# Altium schematic sheet light_key_control.SchDoc
size A3; DocumentNumber: 6; Revision: V1.0; SheetNumber: 6; SheetTotal: 9
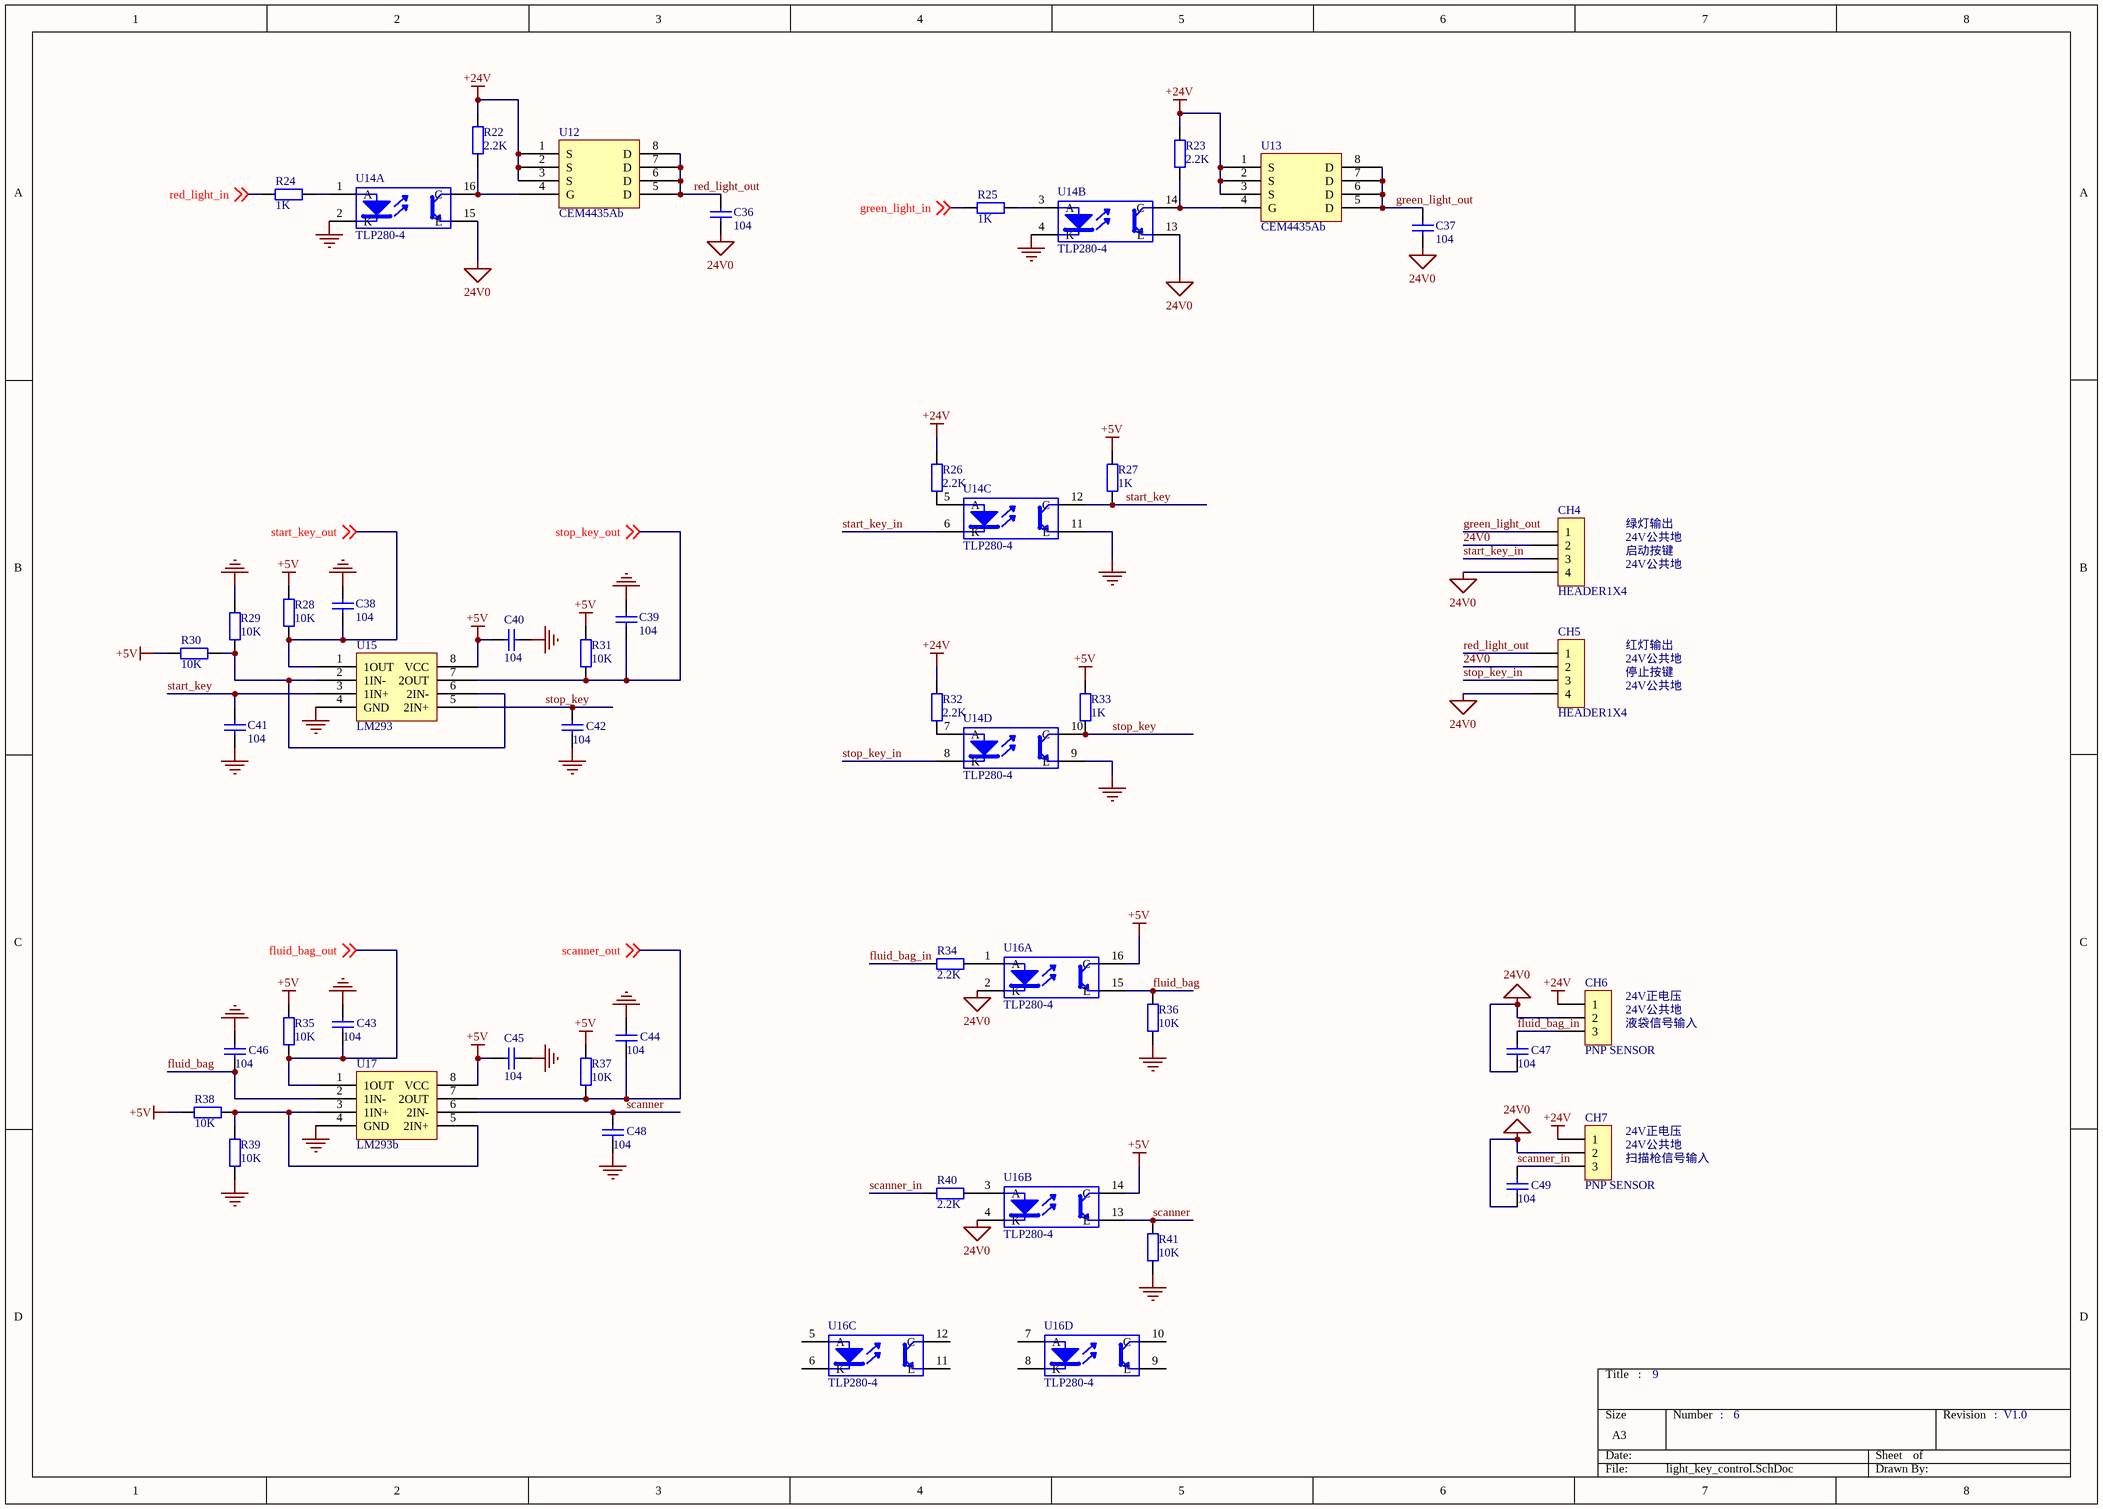
[diagram p0: light_key_control.SchDoc]

## Parts
C36  value 104  [0805]  (hidden comment: Capb)
C37  value 104  [0805]  (hidden comment: Capb)
C38  value 104  [0805]  (hidden comment: Cap)
C39  value 104  [0805]  (hidden comment: Cap)
C40  value 104  [0805]  (hidden comment: Cap)
C41  value 104  [0805]  (hidden comment: Cap)
C42  value 104  [0805]  (hidden comment: Cap)
C43  value 104  [0805]  (hidden comment: Capb)
C44  value 104  [0805]  (hidden comment: Capb)
C45  value 104  [0805]  (hidden comment: Cap)
C46  value 104  [0805]  (hidden comment: Cap)
C47  value 104  [0805]  (hidden comment: Capb)
C48  value 104  [0805]  (hidden comment: Cap)
C49  value 104  [0805]  (hidden comment: Capb)
CH4  HEADER1X4  [CH3.96-4PIN]
CH5  HEADER1X4  [CH3.96-4PIN]
CH6  HEADER1X3  [CH3.96-3PIN]  (value not drawn)
CH7  HEADER1X3  [CH3.96-3PIN]  (value not drawn)
R22  value 2.2K  [0805]  (hidden comment: Res2)
R23  value 2.2K  [0805]  (hidden comment: Res2)
R24  value 1K  [0805]  (hidden comment: Res2)
R25  value 1K  [0805]  (hidden comment: Res2)
R26  value 2.2K  [0805]  (hidden comment: Res2)
R27  value 1K  [0805]  (hidden comment: Res2)
R28  value 10K  [0805]  (hidden comment: Res2)
R29  value 10K  [0805]  (hidden comment: Res2)
R30  value 10K  [0805]  (hidden comment: Res2)
R31  value 10K  [0805]  (hidden comment: Res2)
R32  value 2.2K  [0805]  (hidden comment: Res2)
R33  value 1K  [0805]  (hidden comment: Res2)
R34  value 2.2K  [0805]  (hidden comment: Res2)
R35  value 10K  [0805]  (hidden comment: Res2b)
R36  value 10K  [0805]  (hidden comment: Res2)
R37  value 10K  [0805]  (hidden comment: Res2b)
R38  value 10K  [0805]  (hidden comment: Res2b)
R39  value 10K  [0805]  (hidden comment: Res2b)
R40  value 2.2K  [0805]  (hidden comment: Res2)
R41  value 10K  [0805]  (hidden comment: Res2)
U12  CEM4435Ab  [SOP8-OP27]
U13  CEM4435Ab  [SOP8-OP27]
U14  TLP280-4  [SO16]  (parts A,B,C,D of 4)
U15  LM293  [SOP8-OP27]
U16  TLP280-4  [SO16]  (parts A,B,C,D of 4)
U17  LM293b  [SOP8-OP27]

## Nets
24V0: C36.2 C37.2 C47.1 C49.1 CH4.2 CH4.4 CH5.2 CH5.4 CH6.2 CH7.2 U14.13(E) U14.15(E) U16.2(K) U16.4(K)
+5V: C40.2 C45.2 R27.1 R28.1 R30.1 R31.1 R33.1 R35.1 R37.1 R38.1 U15.8(VCC) U16.14(C) U16.16(C) U17.8(VCC)
+24V: CH6.1 CH7.1 R22.2 R23.2 R26.1 R32.1 U12.1(S) U12.2(S) U12.3(S) U13.1(S) U13.2(S) U13.3(S)
GND: C38.1 C39.1 C40.1 C41.1 C42.1 C43.2 C44.2 C45.1 C46.2 C48.1 R29.1 R36.2 R39.2 R41.2 U14.2(K) U14.4(K) U14.9(E) U14.11(E) U15.4(GND) U17.4(GND)
fluid_bag: C46.1 R36.1 U16.15(E) U17.2(1IN-)
fluid_bag_in: C47.2 CH6.3 R34.1
fluid_bag_out: C43.1 R35.2 U17.1(1OUT) ; off-sheet fluid_bag_out
green_light_in: R25.2 ; off-sheet green_light_in
green_light_out: C37.1 CH4.1 U13.5(D) U13.6(D) U13.7(D) U13.8(D)
red_light_in: R24.2 ; off-sheet red_light_in
red_light_out: C36.1 CH5.1 U12.5(D) U12.6(D) U12.7(D) U12.8(D)
scanner: C48.2 R41.1 U16.13(E) U17.6(2IN-)
scanner_in: C49.2 CH7.3 R40.1
scanner_out: C44.1 R37.2 U17.7(2OUT) ; off-sheet scanner_out
start_key: C41.2 R27.2 U14.12(C) U15.3(1IN+)
start_key_in: CH4.3 U14.6(K)
start_key_out: C38.2 R28.2 U15.1(1OUT) ; off-sheet start_key_out
stop_key: C42.2 R33.2 U14.10(C) U15.5(2IN+)
stop_key_in: CH5.3 U14.8(K)
stop_key_out: C39.2 R31.2 U15.7(2OUT) ; off-sheet stop_key_out
NetR22_1: R22.1 U12.4(G) U14.16(C)
NetR23_1: R23.1 U13.4(G) U14.14(C)
NetR24_1: R24.1 U14.1(A)
NetR25_1: R25.1 U14.3(A)
NetR26_2: R26.2 U14.5(A)
NetR29_2: R29.2 R30.2 U15.2(1IN-) U15.6(2IN-)
NetR32_2: R32.2 U14.7(A)
NetR34_2: R34.2 U16.1(A)
NetR38_2: R38.2 R39.1 U17.3(1IN+) U17.5(2IN+)
NetR40_2: R40.2 U16.3(A)

Not connected (* = marked no-connect by the designer): U16 5(A) 6(K) 7(A) 8(K) 9(E) 10(C) 11(E) 12(C)

## Notes on the sheet
- 绿灯输出
- 24V公共地
- 启动按键
- 红灯输出
- 停止按键
- (near CH6) 液袋信号输入
- (near CH6) 24V公共地
- (near CH6) 24V正电压
- (near CH7) 24V公共地
- (near CH7) 扫描枪信号输入
- (near CH7) 24V正电压
- :
- (in symbol HEADER1X3) PNP SENSOR

## Library data of the parts
C36-C49 = Cap: Capacitor; Published: 8-Jun-2000; LatestRevisionDate: 17-Jul-2002; LatestRevisionNote: Re-released for DXP Platform.; PackageReference: RAD-0.3; Publisher: Altium Limited
R22-R41 = Res2: Resistor; Published: 8-Jun-2000; LatestRevisionDate: 17-Jul-2002; LatestRevisionNote: Re-released for DXP Platform.; PackageReference: AXIAL-0.4; Publisher: Altium Limited
U12 U13 = CEM4435A
U14 U16 = TLP521-4
U17 = LM293